# EAGLE design design_bci (EAGLE 9.6.2)
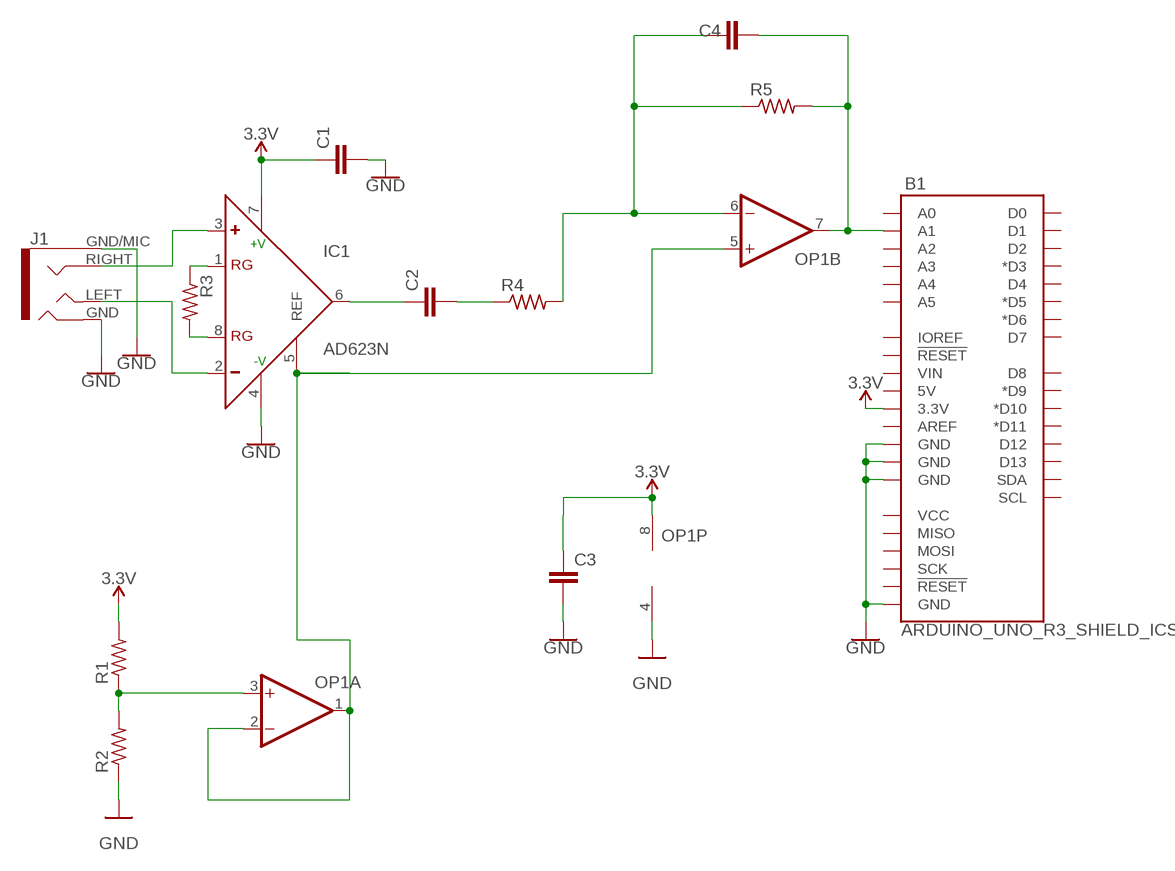
[diagram p0: schematic, sheet 1]

## Parts
B1  ARDUINO_UNO_R3_SHIELD_ICSP  [UNO_R3_SHIELD_ICSP]
C1  CAPACITOR0603  [C0603]
C2  CAPACITOR0603  [C0603]
C3  CAPACITOR0603  [C0603]
C4  CAPACITOR0603  [C0603]
IC1  AD623N  [DIL08]
J1  AUDIO_JACK_TRRSSMD_RA  [AUDIO_JACK_3.5MM_TRRS_SMD_RA]
OP1  OP-DUALMCP6002R  [SO8]
R1  RESISTOR0603  [R0603]
R2  RESISTOR0603  [R0603]
R3  RESISTOR0603  [R0603]
R4  RESISTOR0603  [R0603]
R5  RESISTOR0603  [R0603]

## Nets
3.3V: B1.3.3V C1.1 C3.1 IC1.7(+V) OP1.8(P:V+) R1.2
GND: B1.GND@0(GND) B1.GND@1(GND) B1.GND@2(GND) B1.GND_ICSP(GND) C1.2 C3.2 IC1.4(-V) J1.GND(RING2) J1.GND/MIC(SLEEVE) OP1.4(P:V-) R2.1
N$1: IC1.8(RG) R3.2
N$2: IC1.1(RG) R3.1
N$3: OP1.3(A:+IN) R1.1 R2.2
N$4: C2.1 IC1.6(OUT)
N$5: C2.2 R4.1
N$6: IC1.5(REF) OP1.1(A:OUT) OP1.2(A:-IN) OP1.5(B:+IN)
N$7: C4.1 OP1.6(B:-IN) R4.2 R5.1
N$8: B1.A1 C4.2 OP1.7(B:OUT) R5.2
N$9: IC1.3(+) J1.RIGHT(RING1)
N$10: IC1.2(-) J1.LEFT(TIP)
Unconnected: B1.5V B1.5V_ICSP(VCC) B1.A0 B1.A2 B1.A3 B1.A4 B1.A5 B1.AREF B1.D2 B1.D3(*D3) B1.D4 B1.D5(*D5) B1.D6(*D6) B1.D7 B1.D8 B1.D9(*D9) B1.D10(*D10) B1.D11(*D11) B1.D12 B1.D13 B1.IOREF B1.MISO B1.MOSI B1.RES(!RESET!) B1.RST_ICSP(!RESET!) B1.RX(D0) B1.SCK B1.SCL B1.SDA B1.TX(D1) B1.VIN

## Library data of the parts
B1 = LinnesLab-Microcontrollers:ARDUINO_UNO_R3_SHIELD_ICSP: Arduino R3 Shield Footprint with ICSP Header Includes pins for 6-pin (2x3) ICSP Header. Compatible with Leonardo boards that require SPI pin connections via this header. SparkFun Products: CryptoShield <https://www.sparkfun.com/products/13183> microSD Shield <https://www.sparkfun.com/products/12761> R3 Stackable Headers Kit <https://www.sparkfun.com/products/1417>
C1-C4 = LinnesLab-Passives:CAPACITOR
IC1 = LinnesLab-AnalogIC:AD623: Single-Supply, Rail-to-Rail, Low Cost Instrumentation Amplifier Source: http://www.analog.com/static/imported-files/data_sheets/AD623.pdf; MF: ALTERA CORPORATION; MPN: AD623ANZ; OC_FARNELL: 9603700; OC_NEWARK: 59K4402
J1 = LinnesLab-Connectors:AUDIO_JACK_TRRS: Audio Jack - 3.5mm TRRS (SMD) This is a 3.5mm TRRS SMD audio jack. TRRS connectors are the audio-style connectors that you see on some phones, MP3 players and development boards. TRRS stands for “tip, ring, ring, sleeve,” which reflects that this has three conductors and a ground. SparkFun Products: Audio Jack <https://www.sparkfun.com/products/12639> mbed Starter Kit <https://www.sparkfun.com/products/12968> SparkFun TRRS 3.5mm Jack Breakout <https://www.sparkfun.com/products/11570>; PROD_ID: CONN-10676; SF_ID: PRT-12639
OP1 = LinnesLab-AnalogIC:OP-DUAL: Precision Micropower, Low Noise CMOS, Rail-to-Rail Input/Output Operational Amplifiers Source: http://www.analog.com/static/imported-files/data_sheets/AD8603_8607_8609.pdf; DIGIKEY: MCP6002T-I/SNCT-ND; MF: Microchip Technology; MPN: MCP6002T-I/SN
R1-R5 = LinnesLab-Passives:RESISTOR

## Board
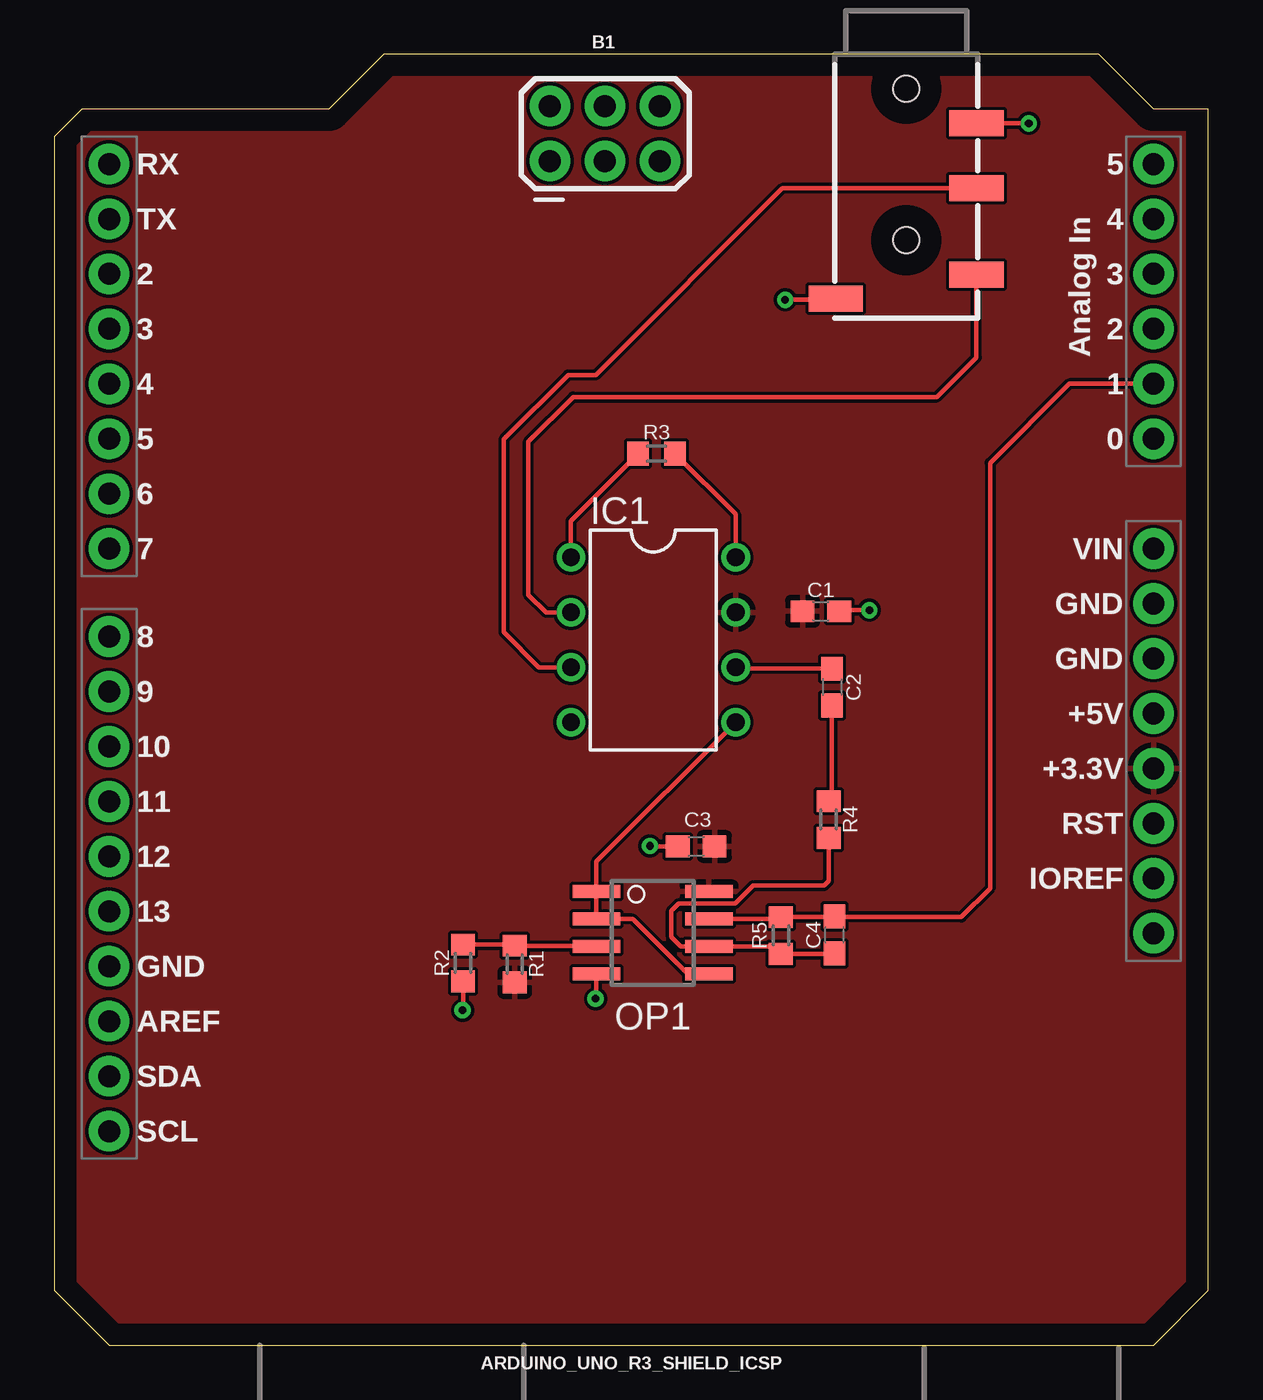
[diagram p1: board, top side]
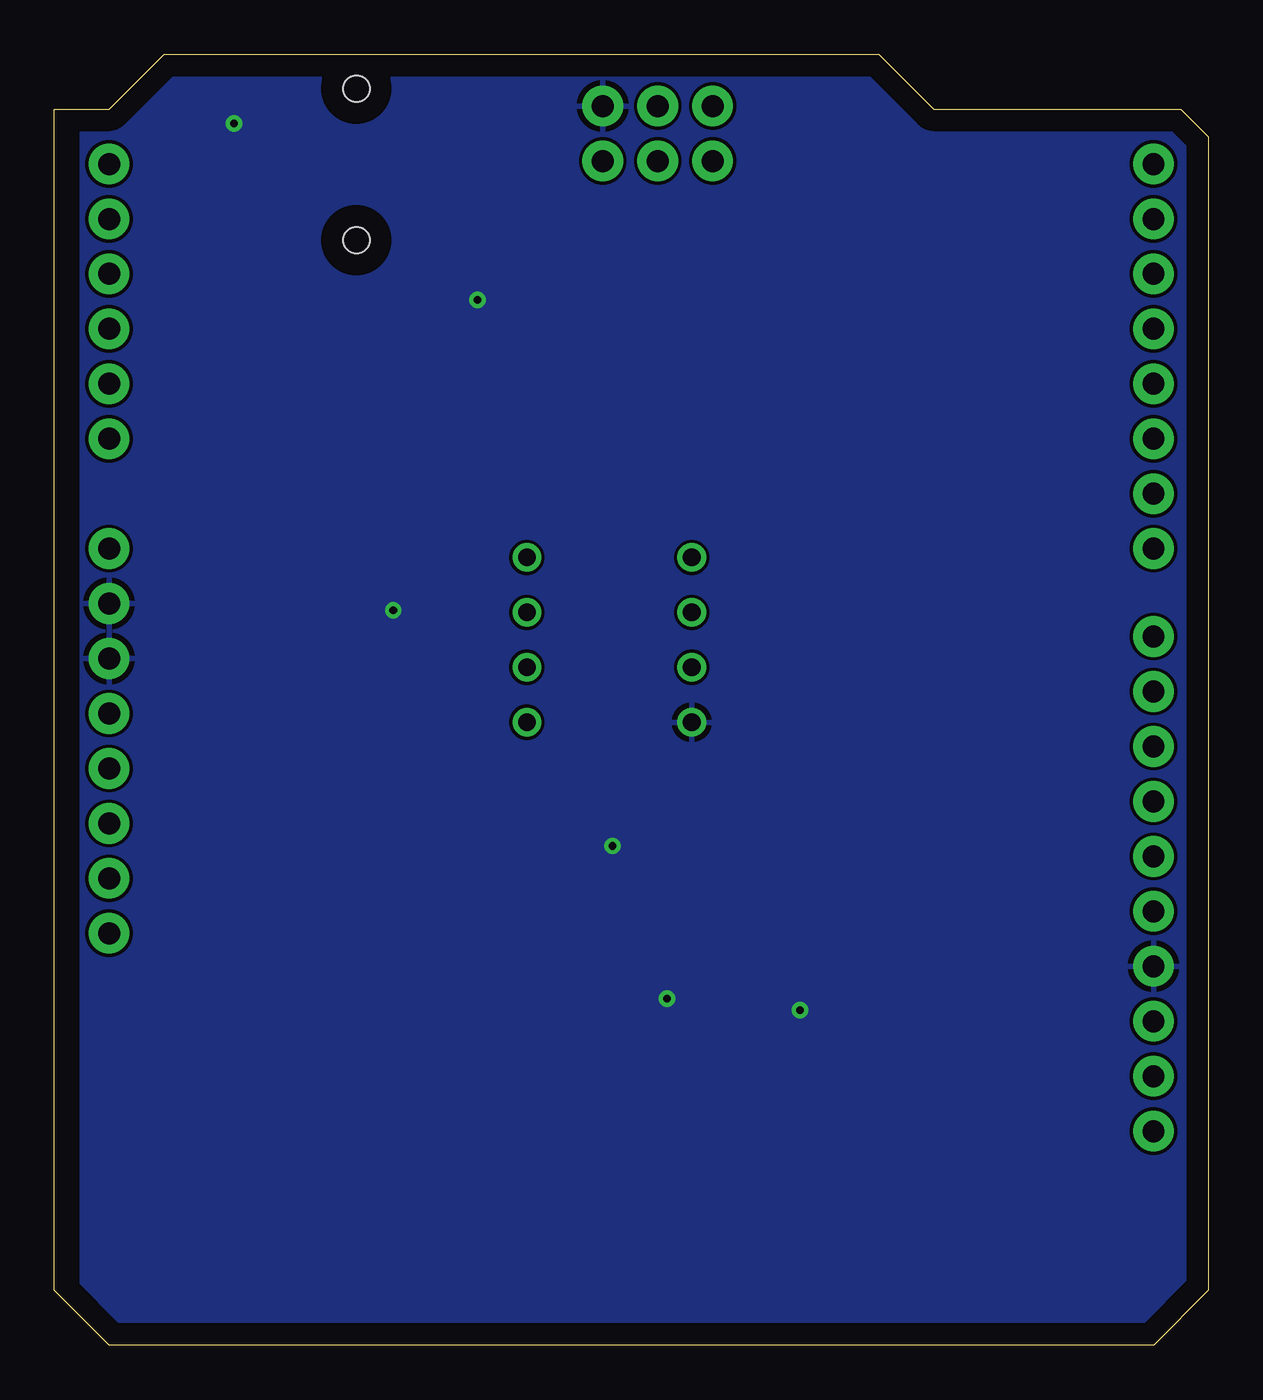
[diagram p2: board, bottom side, seen from below]

Size 53.34 x 59.69 mm. Coordinates in mm from the lower left corner, seen from the top.
Copper layers (1*16): Top 0.035mm / dielectric 1.5mm / Bottom 0.035mm
Design rules "default": minimum track width 6mil, minimum drill 0.35mm, track to track 6mil, track to pad 6mil, pad to pad 6mil, via to via 6mil, smd to smd 6mil, copper to edge 40mil, drill to drill 6mil, minimum pad ring 10mil, minimum via ring 8mil, stop-mask expansion 4mil, vias tented up to drill 0mil, thermal gap 10mil

### Footprints (pad centres in the part's own frame; a part is rotated, then mirrored left to right if it is on the bottom)
UNO_R3_SHIELD_ICSP = drill 1.016 pad 1.88: 3.3V 24.13,-3.81; 5V 24.13,-1.27; 5V_ICSP -3.76,26.81; A0 24.13,11.43; A1 24.13,13.97; A2 24.13,16.51; A3 24.13,19.05; A4 24.13,21.59; A5 24.13,24.13; AREF -24.13,-15.494; D2 -24.13,19.05; D3 -24.13,16.51; D4 -24.13,13.97; D5 -24.13,11.43; D6 -24.13,8.89; D7 -24.13,6.35; D8 -24.13,2.286; D9 -24.13,-0.254; D10 -24.13,-2.794; D11 -24.13,-5.334; D12 -24.13,-7.874; D13 -24.13,-10.414; GND@0 24.13,1.27; GND@1 24.13,3.81; GND@2 -24.13,-12.954; GND_ICSP 1.32,26.81; IOREF 24.13,-8.89; MISO -3.76,24.27; MOSI -1.22,26.81; NC 24.13,-11.43; RES 24.13,-6.35; RST_ICSP 1.32,24.27; RX -24.13,24.13; SCK -1.22,24.27; SCL -24.13,-20.574; SDA -24.13,-18.034; TX -24.13,21.59; VIN 24.13,6.35
C0603 = smd 1.1 x 1: 1 -0.85,0; 2 0.85,0
DIL08 = drill 0.813 pad 1.27: 1 -3.81,-3.81; 2 -1.27,-3.81; 3 1.27,-3.81; 4 3.81,-3.81; 5 3.81,3.81; 6 1.27,3.81; 7 -1.27,3.81; 8 -3.81,3.81
AUDIO_JACK_3.5MM_TRRS_SMD_RA = smd 1.2 x 2.5: GND 3.2,3.25; GND/MIC 11.3,-3.25; LEFT 10.2,3.25; RIGHT 6.2,3.25 | hole 1.2: 1.6,0; 8.6,0
SO8 = smd 0.6 x 2.2: 1 -1.905,-2.6; 2 -0.635,-2.6; 3 0.635,-2.6; 4 1.905,-2.6; 5 1.905,2.6; 6 0.635,2.6; 7 -0.635,2.6; 8 -1.905,2.6
R0603 = smd 1 x 1.1: 1 -0.85,0; 2 0.85,0

### Placement (x,y rotation side)
B1  26.67,30.48 0 top
C1  35.43,33.93 0 top
C2  35.94,30.43 270 top
C3  29.67,23.06 180 top
C4  36.07,18.97 90 top
IC1  27.69,32.61 270 top
J1  39.37,59.69 270 top
OP1  27.66,19.08 270 top
R1  21.29,17.63 270 top
R2  18.9,17.68 90 top
R3  27.84,41.22 0 top
R4  35.79,24.31 270 top
R5  33.58,18.95 90 top

### Tracks (layer width: path | path; a pad name or v marks a point on that pad's centre or on a via)
3.3V
  pour Top: 0,59.69 53.34,59.69 53.34,0 0,0
GND  (via drill 0.35)
  Top 0.203: OP1.4 25.06,16.07 v25.02,16.03 | R2.1 18.9,15.52 v18.87,15.49 | C1.2 36.33,33.98 v37.67,33.98 | C3.2 27.56,23.06 v27.53,23.09 | J1.GND v45.03,56.49 | v45.03,56.49 | J1.GND/MIC 36.07,48.34 v33.78,48.34
  pour Bottom: 0,59.69 52.07,59.69 52.07,0 0,0
N$1
  Top 0.203: R3.2 31.5,38.42 IC1.8
N$2
  Top 0.203: R3.1 23.88,38.11 IC1.1
N$3
  Top 0.203: R2.2 21.23,18.53 R1.1 25.02,18.48 OP1.3
N$4
  Top 0.203: C2.1 31.56,31.28 IC1.6
N$5
  Top 0.203: C2.2 35.94,25.31 R4.1
N$6
  Top 0.203: IC1.5 25.06,22.37 OP1.1 OP1.2 26.75,19.71 29.29,17.17 OP1.5
N$7
  Top 0.203: R4.2 35.79,21.46 35.59,21.26 32.3,21.26 31.47,20.43 28.86,20.43 28.52,20.09 28.52,18.87 28.96,18.44 OP1.6 33.24,18.44 R5.1 36.04,18.1 C4.1
N$8
  Top 0.203: OP1.7 33.49,19.71 R5.2 36.04,19.8 | 36.04,19.8 C4.2 | B1.A1 46.91,44.45 43.26,40.79 43.26,21.13 41.92,19.8 36.04,19.8
N$9
  Top 0.203: IC1.3 22.4,31.34 20.78,32.97 20.78,41.88 23.75,44.86 25.02,44.86 33.65,53.49 J1.RIGHT
N$10
  Top 0.203: IC1.2 22.73,33.88 21.92,34.7 21.92,41.78 23.98,43.84 40.79,43.84 42.62,45.67 J1.LEFT